# Altium schematic sheet documentation.SchDoc
size A4; SheetNumber: 4; SheetTotal: 4; SPICEModelCachePVHZZWKU: <root> / <DocumentId>PVHZZWKU</DocumentId> / <CacheFrame Number="0"> / <Model Name="bat18" Kind="MDL"> / <Text>***************************************************************** / * BAT18 Diode Model / .MODEL BAT18 D(IS=185F RS=.30 N=1.305 BV=70 IBV=.1N / + CJO=1.17P VJ=.12 M=.096 TT=125N)</Text> / </Model> / </CacheFrame> / </root>
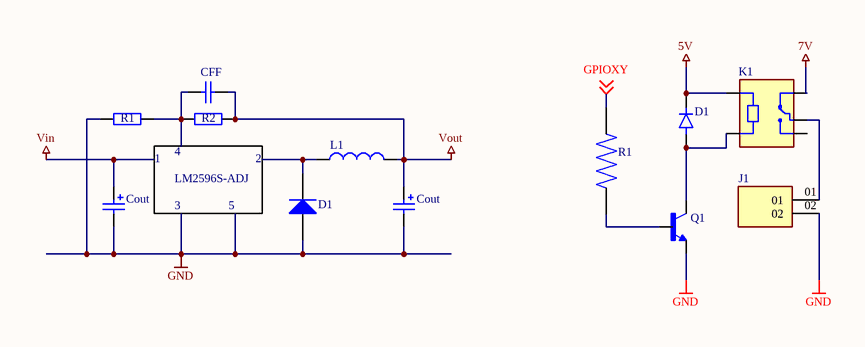
[diagram p0: documentation.SchDoc]

## Parts
(Parts that share a designator on the sheet are numbered #1, #2 ... from top to bottom, then left to right.)
CFF  Cap  [RAD-0.3]  (value not drawn)
Cout#1  Cap Pol2  [POLAR0.8]  (value not drawn)
Cout#2  Cap Pol2  [POLAR0.8]  (value not drawn)
D1#1  FDLL4148  [DIOMELF3414N]  (value not drawn)
D1#2  Diode BAT18  [SOT-23_N]  (value not drawn)
J1  BBS-102-T-A  [SAMTEC_BBS-102-T-A]  (value not drawn)
K1  SRD-05VDC-SL-C  [RELAY_SRD-05VDC-SL-C]  (value not drawn)
L1  Inductor  [0402-A]  (value not drawn)
Q1  BC817-40  [SOT95P240X120-3N]  (value not drawn)
R1#1  Res2  [AXIAL-0.4]  (value not drawn)
R1#2  ERJB3CFR15V  [RES_ERJB3CFR15V]  (value not drawn)
R2  Res2  [AXIAL-0.4]  (value not drawn)

## Nets
5V: D1#1.C K1.A2
7V: K1.NC
GND: Cout#1.2 Cout#2.2 D1#2.1(A) J1.02 Q1.2(E) R1#1.1
Vin: Cout#1.1
Vout: CFF.2 Cout#2.1 L1.2 R2.2
GPIOXY: R1#2.2 ; off-sheet GPIOXY
NetCFF_1: CFF.1 R1#1.2 R2.1
NetD1#1_A: D1#1.A K1.A1 Q1.3(C)
NetD1#2_3: D1#2.3(K) L1.1
NetJ1_01: J1.01 K1.COM
NetQ1_1: Q1.1(B) R1#2.1

Not connected (* = marked no-connect by the designer): K1 NO

## Notes on the sheet
- 1
- 4
- 2
- 3
- LM2596S-ADJ
- 5

## Library data of the parts
CFF = Cap: Capacitor; Value: 100pF; Published: 8-Jun-2000; LatestRevisionDate: 17-Jul-2002; LatestRevisionNote: Re-released for DXP Platform.; PackageReference: RAD-0.3; Publisher: Altium Limited; PackageDescription: Radial Cap, Thru-Hole; 2 Leads; 0.3 in Pin Spacing
Cout#1 Cout#2 = Cap Pol2: Polarized Capacitor (Axial); Value: 100pF; Published: 8-Jun-2000; LatestRevisionDate: 17-Jul-2002; LatestRevisionNote: Re-released for DXP Platform.; PackageReference: POLAR0.8; Publisher: Altium Limited; PackageDescription: Polarized Capacitor; 2 Leads
D1#1 = FDLL4148: Diode Standard 100 V 200mA Surface Mount SOD-80; MF: ON Semiconductor; SnapEDA_Link: https://www.snapeda.com/parts/FDLL4148/Onsemi/view-part/?ref=snap; Package: SOD-80-2 ON Semiconductor; Value: *; MP: FDLL4148; Check_prices: https://www.snapeda.com/parts/FDLL4148/Onsemi/view-part/?ref=eda
D1#2 = Diode BAT18: Low-Loss RF Switching Diode; Note: Pin 2 is not connected and not drawn.; Published: 21-Mar-2003; LatestRevisionDate: 29-May-2009; LatestRevisionNote: IPC-7351 Footprint Added.; DatasheetVersion: Oct-1999; PackageVersion: Sep-2001; PackageReference: SOT-23; Publisher: Altium Limited; PackageDescription: 3-Pin SOT-23 Package 0.95 mm Pitch, 2.5 mm Lead Span; ComponentLink1Description: Manufacturer Link; ComponentLink1URL: http://www.infineon.com/
J1 = BBS-102-T-A: HEADER, 2.54MM, PCB, 1X2 POSITION; Product Range:BBS Series; No. of Contacts:2Contacts; Gender:Header; Pitch Spacing:2.54mm; Contact Termination Type:Through Hole; No. of Rows:1Rows; Contact Plating:Tin Plated Contacts RoHS Compliant: Yes; MF: Samtec; MP: BBS102TA; SnapEDA_Link: https://www.snapeda.com/parts/BBS102TA/Samtec/view-part/?ref=snap; Package: None; Value: *; Check_prices: https://www.snapeda.com/parts/BBS102TA/Samtec/view-part/?ref=eda
K1 = SRD-05VDC-SL-C: 5V Trigger Relay Module For Arduino And Raspberry Pi 5V Trigger Relay Module For Arduino And Raspberry Pi; MF: Songle Relay; Check_prices: https://www.snapeda.com/parts/SRD-05VDC-SL-C/Songle+Relay/view-part/?ref=eda; Value: *; Availability: Not in stock; Price: None; Package: NON STANDARD-5 Songle Relay; MP: SRD-05VDC-SL-C; SnapEDA_Link: https://www.snapeda.com/parts/SRD-05VDC-SL-C/Songle+Relay/view-part/?ref=snap
L1 = Inductor: Code_IEC: 1005; Value: 10mH; Published: 8-Jun-2000; LatestRevisionDate: 29-May-2009; LatestRevisionNote: IPC-7351 Footprint Added.; PackageReference: 0402-A; Publisher: Altium Limited; PackageDescription: Chip Inductor; Code_JEITA: 0402
Q1 = BC817-40: BJT, SOT-23, 45V, 800mA, NPN, 0.31W, 150Â°C; MF: Diotec Semiconductor; SnapEDA_Link: https://www.snapeda.com/parts/BC817-40/Diotec/view-part/?ref=snap; Package: SOT-23 Diotec; Value: *; MP: BC817-40; Check_prices: https://www.snapeda.com/parts/BC817-40/Diotec/view-part/?ref=eda
R1#1 R2 = Res2: Resistor; Value: 1K; Published: 8-Jun-2000; LatestRevisionDate: 17-Jul-2002; LatestRevisionNote: Re-released for DXP Platform.; PackageReference: AXIAL-0.4; Publisher: Altium Limited; PackageDescription: Axial Device, Thru-Hole; 2 Leads; 0.4 in Pin Spacing
R1#2 = ERJB3CFR15V: Value: 1k; MP: ERJB3CFR15V; Package: None; Price: None; Availability: Unavailable